# EAGLE design stm32G031J6M6-Breakout (EAGLE 9.5.2)
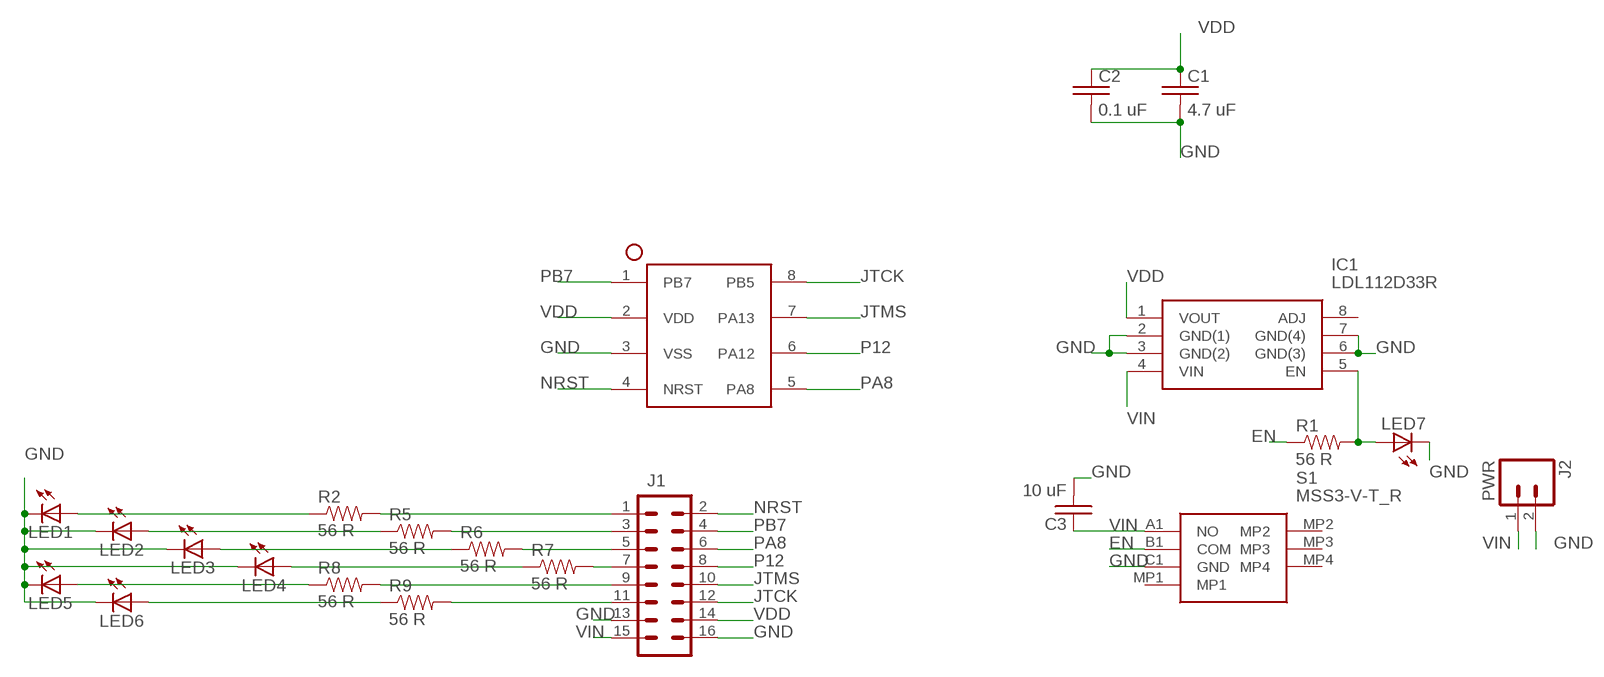
[diagram p0: schematic, sheet 1]

## Parts
C1  4.7 uF  C-USC0805K  [C0805K]
C2  0.1 uF  C-USC0805K  [C0805K]
C3  10 uF  C-USC0805K  [C0805K]
IC1  LDL112D33R  [SOIC127P600X175-8N]
J1  M08X2  [2X8]
J2  PWR  M02PTH  [1X02]
LED1  LED1206  [LED-1206]
LED2  LED1206  [LED-1206]
LED3  LED1206  [LED-1206]
LED4  LED1206  [LED-1206]
LED5  LED1206  [LED-1206]
LED6  LED1206  [LED-1206]
LED7  LED1206  [LED-1206]
R1  56 R  RESISTOR1206  [1206]
R2  56 R  RESISTOR1206  [1206]
R5  56 R  RESISTOR1206  [1206]
R6  56 R  RESISTOR1206  [1206]
R7  56 R  RESISTOR1206  [1206]
R8  56 R  RESISTOR1206  [1206]
R9  56 R  RESISTOR1206  [1206]
S1  MSS3-V-T_R  [MSS3VTR]
U$1  STM32G031S08N  [SOIC127P600X175-8N]

## Nets
EN: R1.1 S1.B1(COM)
GND: C1.2 C2.2 C3.2 IC1.2(GND(1)) IC1.3(GND(2)) IC1.6(GND(3)) IC1.7(GND(4)) J1.13 J1.16 J2.2 LED1.C LED2.C LED3.C LED4.C LED5.C LED6.C LED7.C S1.C1(GND) U$1.3(VSS)
JTCK: J1.12 U$1.8(PB5)
JTMS: J1.10 U$1.7(PA13)
N$2: J1.1 R2.2
N$3: J1.3 R5.2
N$4: J1.5 R6.2
N$5: J1.7 R7.2
N$6: J1.9 R8.2
N$7: J1.11 R9.2
N$8: LED1.A R2.1
N$9: LED2.A R5.1
N$10: LED3.A R6.1
N$11: LED4.A R7.1
N$12: LED5.A R8.1
N$13: LED6.A R9.1
N$14: IC1.5(EN) LED7.A R1.2
NRST: J1.2 U$1.4(NRST)
P12: J1.8 U$1.6(PA12)
PA8: J1.6 U$1.5(PA8)
PB7: J1.4 U$1.1(PB7)
VDD: C1.1 C2.1 IC1.1(VOUT) J1.14 U$1.2(VDD)
VIN: C3.1 IC1.4(VIN) J1.15 J2.1 S1.A1(NO)
Unconnected: IC1.8(ADJ) S1.MP1 S1.MP2 S1.MP3 S1.MP4

## Library data of the parts
C1-C3 = passives:C-US: CAPACITOR, American symbol
IC1 = voltage-regulator:LDL112D33R: LDO Voltage Regulators 1.2 A low quiescent current LDO with reverse current protection Source: Datasheet <https://www.arrow.com/en/products/ldl112d33r/stmicroelectronics>; ARROW_PART_NUMBER: LDL112D33R; ARROW_PRICE/STOCK: https://www.arrow.com/en/products/ldl112d33r/stmicroelectronics; DESCRIPTION: LDO Voltage Regulators 1.2 A low quiescent current LDO with reverse current protection; HEIGHT: 1.75mm; MANUFACTURER_NAME: STMicroelectronics; MANUFACTURER_PART_NUMBER: LDL112D33R
J1 = connector:M08X2: .1" headers, two rows of 8 each
J2 = connector:M02: Standard 2-pin 0.1" header. Use with - straight break away headers ( PRT-00116) - right angle break away headers (PRT-00553) - swiss pins (PRT-00743) - machine pins (PRT-00117) - female headers (PRT-00115) Molex polarized connector foot print use with: PRT-08233 with associated crimp pins and housings. 2.54_SCREWTERM for use with PRT-10571. 3.5mm Screw Terminal footprints for PRT-08084 5mm Screw Terminal footprints for use with PRT-08432
LED1-LED7 = leds:LED: LEDs Standard schematic elements and footprints for 5mm, 3mm, 1206, and 0603 sized LEDs. 5mm - Spark Fun Electronics SKU : COM-00529 (and others)
R1 R2 R5-R9 = passives:RESISTOR: Resistor Basic schematic elements and footprints for 0603, 1206, and PTH resistors.
S1 = switches:MSS3-V-T_R: Slide Switches Slide Type 1P2T (1.4mm height) Source: Datasheet <http://www.dip.com.tw/en/en-product-information/en-switch005/item/download/2643_3624e6da26abd0f9c3465d69564276ea>; DESCRIPTION: Slide Switches Slide Type 1P2T (1.4mm height); HEIGHT: 1.4mm; MANUFACTURER_NAME: Diptronics; MANUFACTURER_PART_NUMBER: MSS3-V-T/R; MOUSER_PART_NUMBER: 113-MSS3-V-T/R; MOUSER_PRICE-STOCK: https://www.mouser.com/Search/Refine.aspx?Keyword=113-MSS3-V-T%2FR
U$1 = ICs:STM32G031

## Board
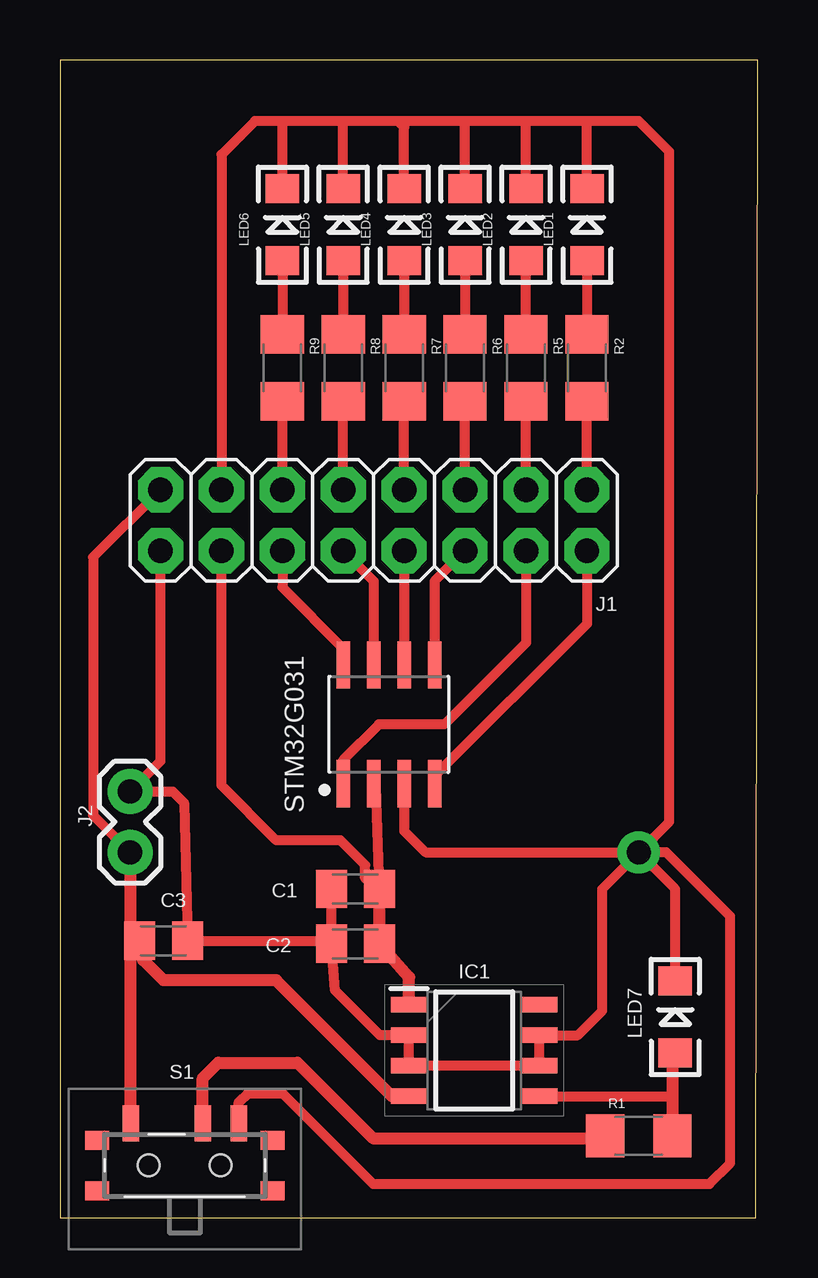
[diagram p1: board, top side]

Size 29.09 x 48.27 mm. Coordinates in mm from the lower left corner, seen from the top.
Outline: 0,0 29,0 29.09,48.27 0,48.27 0,0
Copper layers (1*16): Top 0.035mm / dielectric 1.5mm / Bottom 0.035mm
Design rules "OthermillDRC_1_64_v2": minimum track width 16mil, minimum drill 31mil, track to track 0.39878125mm, track to pad 0.39878125mm, pad to pad 0.39878125mm, via to via 0.39878125mm, smd to smd 0mil, copper to edge 0mil, drill to drill 1mil, minimum pad ring 0mil, minimum via ring 15mil, stop-mask expansion 1mil, vias tented up to drill 30mil, thermal gap 10mil

### Footprints (pad centres in the part's own frame; a part is rotated, then mirrored left to right if it is on the bottom)
C0805K = smd 1.3 x 1.6: 1 -1,0; 2 1,0
SOIC127P600X175-8N = smd 1.525 x 0.65: 1 -2.712,1.905; 2 -2.712,0.635; 3 -2.712,-0.635; 4 -2.712,-1.905; 5 2.712,-1.905; 6 2.712,-0.635; 7 2.712,0.635; 8 2.712,1.905
2X8 = drill 1.016 pad 1.88 octagon: 1 0,0; 2 0,2.54; 3 2.54,0; 4 2.54,2.54; 5 5.08,0; 6 5.08,2.54; 7 7.62,0; 8 7.62,2.54; 9 10.16,0; 10 10.16,2.54; 11 12.7,0; 12 12.7,2.54; 13 15.24,0; 14 15.24,2.54; 15 17.78,0; 16 17.78,2.54
1X02 = drill 1.016 pad 1.88: 1 0,0; 2 2.54,0
LED-1206 = smd 1.2 x 1.4: A -1.5,0; C 1.5,0
1206 = smd 1.6 x 1.8: 1 -1.4,0; 2 1.4,0
MSS3VTR = smd 0.7 x 1.5: A1 -2.25,3.05; B1 0.75,3.05; C1 2.25,3.05 | smd 1 x 0.8: MP1 -3.65,2.35; MP2 -3.65,0.25; MP3 3.65,0.25; MP4 3.65,2.35 | hole 0.9: -1.5,1.3; 1.5,1.3
SOIC127P600X175-8N' = smd 1.968 x 0.569: 1 -2.473,1.905; 2 -2.473,0.635; 3 -2.473,-0.635; 4 -2.473,-1.905; 5 2.473,-1.905; 6 2.473,-0.635; 7 2.473,0.635; 8 2.473,1.905

### Placement (x,y rotation side)
C1  12.32,13.72 180 top
C2  12.32,11.43 180 top
C3  4.32,11.56 0 top
IC1  17.27,6.99 0 top
J1  21.97,30.35 180 top
J2  2.92,15.24 90 top
LED1  21.97,41.4 90 top
LED2  19.43,41.4 90 top
LED3  16.89,41.4 90 top
LED4  14.35,41.4 90 top
LED5  11.81,41.4 90 top
LED6  9.27,41.4 90 top
LED7  25.65,8.38 90 top
R1  24.13,3.43 0 top
R2  21.97,35.43 270 top
R5  19.43,35.43 270 top
R6  16.89,35.43 270 top
R7  14.35,35.43 270 top
R8  11.81,35.43 270 top
R9  9.27,35.43 270 top
S1  5.21,0.89 0 top
U$1  STM32G031S08N  [SOIC127P600X175-8N']  13.72,20.57 90 top

### Tracks (layer width: path | path; a pad name or v marks a point on that pad's centre or on a via)
EN
  Top 0.508: S1.B1 5.96,5.83 6.6,6.48 9.91,6.48 13.08,3.3 22.6,3.3 R1.1
GND  (via drill 1)
  Top 0.406: C2.2 11.34,11.56 C3.2 5.17,17.31 4.7,17.78 J2.2 4.19,19.05 J1.16 | C2.2 C1.2 | C2.2 11.47,9.49 13.34,7.62 IC1.2 IC1.3 IC1.6 IC1.7 21.59,7.62 22.61,8.64 22.61,13.72 v24.13,15.24 | 21.84,45.72 24.13,45.72 25.4,44.45 25.4,16.51 v24.13,15.24 | 21.84,45.72 19.3,45.72 | 19.3,45.72 16.89,45.72 | 16.89,45.72 14.1,45.72 | 14.1,45.72 11.81,45.72 | 11.81,45.72 9.4,45.72 | 9.4,45.72 8.13,45.72 6.73,44.32 J1.13 | LED6.C 9.27,45.59 9.4,45.72 | LED5.C 11.81,45.72 | LED4.C 14.35,45.47 14.1,45.72 | LED3.C 16.89,45.72 | LED2.C 19.43,45.59 19.3,45.72 | LED1.C 21.97,45.59 21.84,45.72 | S1.C1 7.46,4.83 7.84,5.21 9.27,5.21 13.06,1.42 27.07,1.42 27.94,2.29 27.94,12.57 25.27,15.24 v24.13,15.24 | U$1.3 14.35,16.13 15.24,15.24 v24.13,15.24 | LED7.C 25.65,13.72 v24.13,15.24
JTCK
  Top 0.406: J1.12 9.27,26.29 11.81,23.75 U$1.8
JTMS
  Top 0.406: J1.10 13.08,26.54 U$1.7
N$2
  Top 0.406: J1.1 R2.2
N$3
  Top 0.406: J1.3 R5.2
N$4
  Top 0.406: J1.5 R6.2
N$5
  Top 0.406: J1.7 R7.2
N$6
  Top 0.406: J1.9 R8.2
N$7
  Top 0.406: J1.11 R9.2
N$8
  Top 0.406: LED1.A R2.1
N$9
  Top 0.406: R5.1 LED2.A
N$10
  Top 0.406: LED3.A R6.1
N$11
  Top 0.406: LED4.A R7.1
N$12
  Top 0.406: LED5.A R8.1
N$13
  Top 0.406: LED6.A R9.1
N$14
  Top 0.406: IC1.5 25.53,5.08
  Top 0.508: LED7.A 25.53,6.76 25.53,5.08 R1.2
NRST
  Top 0.406: J1.2 21.97,24.77 15.62,18.42 U$1.4
P12
  Top 0.406: J1.8 U$1.6
PA8
  Top 0.406: J1.6 15.62,26.54 U$1.5
PB7
  Top 0.406: J1.4 19.43,23.98 16.03,20.57 13.3,20.57 11.81,19.09 U$1.1
VDD
  Top 0.406: U$1.2 13.17,18.01 C1.1 12.72,14.16 12.72,14.71 11.69,15.75 9.02,15.75 6.73,18.03 J1.14
  Top 0.508: IC1.1 14.56,10.04 C2.1 C1.1
VIN
  Top 0.406: J1.15 1.38,27.54 1.38,16.78 J2.1
  Top 0.508: J2.1 2.92,12.1 C3.1 | S1.A1 2.96,11.05 C3.1 | IC1.4 13.84,5.08 9.02,9.91 4.32,9.91 3.47,10.76 C3.1

### Text on the board
tNames: STM32G031